# Altium project PCB_XEM-S91.PRJPCB (part 2 of 2)

## Sheet 08_FPGA_D.SchDoc: FPGA Part D: Bank 7-8
size 381 x 266 mm; Organization: Meteroi; Address1: Room 428, 410 Guiping Rd.; Address2: Shanghai 200233, CHINA; SheetNumber: 9; SheetTotal: 11; PageSetup: Record=PageOptions|CenterHorizontal=True|CenterVertical=True|PrintScale=0.75|XCorrection=1.00|YCorrection=1.00|PrintKind=2|BorderSize=5000000|LeftOffset=0|BottomOffset=0|Orientation=2|PaperLength=1000|PaperWidth=1000|Scale=100|PaperSource=276|PrintQuality=-3|MediaType=1|DitherType=10|PaperKind=A4|PrintScaleMode=1
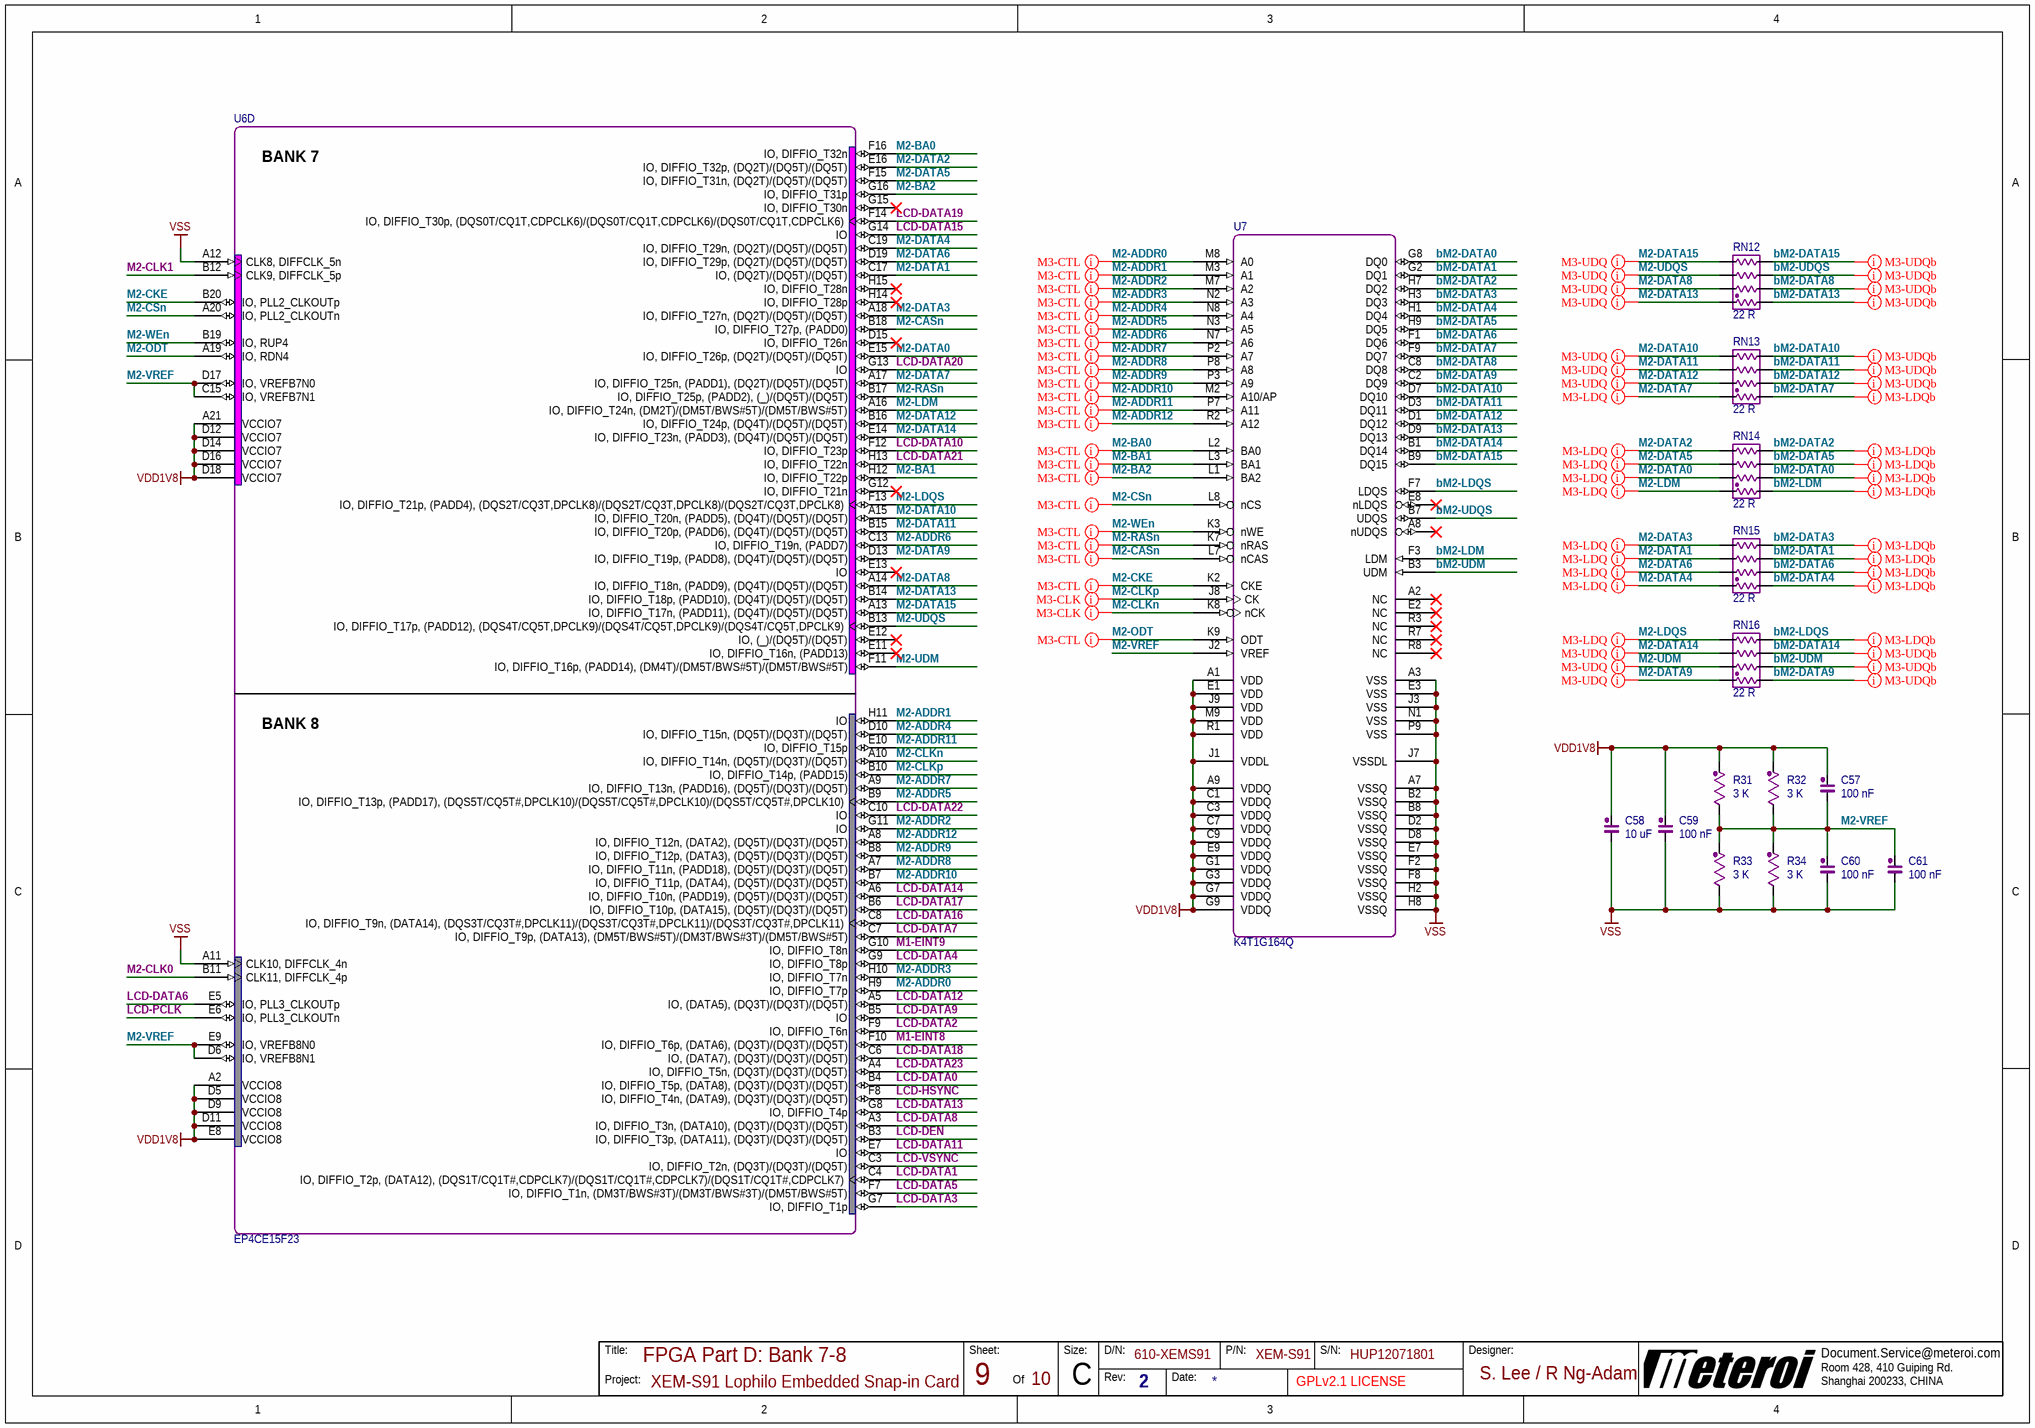
[diagram p7: 08_FPGA_D.SchDoc]

### Parts
C57  100 nF  [0402A1]
C58  10 uF  [0603A1]
C59  100 nF  [0402A1]
C60  100 nF  [0402A1]
C61  100 nF  [0402BG]
R31  3 K  [0402A2]
R32  3 K  [0402A2]
R33  3 K  [0402A2]
R34  3 K  [0402A2]
RN12  22 R  [0402PR4]
RN13  22 R  [0402PR4]
RN14  22 R  [0402PR4]
RN15  22 R  [0402PR4]
RN16  22 R  [0402PR4]
U6  EP4CE15F23  [FBGA-484]  (part D of 5)
U7  K4T1G164Q  [FBGA-DDR-84]

### Nets
VDD1V8: C57.2 C58.2 C59.2 R31.2 R32.2 U6.A2(VCCIO8) U6.A21(VCCIO7) U6.D5(VCCIO8) U6.D9(VCCIO8) U6.D11(VCCIO8) U6.D12(VCCIO7) U6.D14(VCCIO7) U6.D16(VCCIO7) U6.D18(VCCIO7) U6.E8(VCCIO8) U7.A1(VDD) U7.A9(VDDQ) U7.C1(VDDQ) U7.C3(VDDQ) U7.C7(VDDQ) U7.C9(VDDQ) U7.E1(VDD) U7.E9(VDDQ) U7.G1(VDDQ) U7.G3(VDDQ) U7.G7(VDDQ) U7.G9(VDDQ) U7.J1(VDDL) U7.J9(VDD) U7.M9(VDD) U7.R1(VDD)
VSS: C58.1 C59.1 C60.1 C61.1 R33.1 R34.1 U6.A11(CLK10,_DIFFCLK_4n) U6.A12(CLK8,_DIFFCLK_5n) U7.A3(VSS) U7.A7(VSSQ) U7.B2(VSSQ) U7.B8(VSSQ) U7.D2(VSSQ) U7.D8(VSSQ) U7.E3(VSS) U7.E7(VSSQ) U7.F2(VSSQ) U7.F8(VSSQ) U7.H2(VSSQ) U7.H8(VSSQ) U7.J3(VSS) U7.J7(VSSDL) U7.N1(VSS) U7.P9(VSS)
bM2-DATA0: RN14.4 U7.G8(DQ0)
bM2-DATA1: RN15.6 U7.G2(DQ1)
bM2-DATA2: RN14.8 U7.H7(DQ2)
bM2-DATA3: RN15.8 U7.H3(DQ3)
bM2-DATA4: RN15.2 U7.H1(DQ4)
bM2-DATA5: RN14.6 U7.H9(DQ5)
bM2-DATA6: RN15.4 U7.F1(DQ6)
bM2-DATA7: RN13.2 U7.F9(DQ7)
bM2-DATA8: RN12.4 U7.C8(DQ8)
bM2-DATA9: RN16.2 U7.C2(DQ9)
bM2-DATA10: RN13.8 U7.D7(DQ10)
bM2-DATA11: RN13.6 U7.D3(DQ11)
bM2-DATA12: RN13.4 U7.D1(DQ12)
bM2-DATA13: RN12.2 U7.D9(DQ13)
bM2-DATA14: RN16.6 U7.B1(DQ14)
bM2-DATA15: RN12.8 U7.B9(DQ15)
bM2-LDM: RN14.2 U7.F3(LDM)
bM2-LDQS: RN16.8 U7.F7(LDQS)
bM2-UDM: RN16.4 U7.B3(UDM)
bM2-UDQS: RN12.6 U7.B7(UDQS)
LCD-DATA0: U6.B4(IO,_DIFFIO_T5p,_(DATA8),_(DQ3T)/(DQ3T)/(DQ5T))
LCD-DATA1: U6.C4(IO,_DIFFIO_T2p,_(DATA12),_(DQS1T/CQ1T#,CDPCLK7)/(DQS1T/CQ1T#,CDPCLK7)/(DQS1T/CQ1T#,CDPCLK7))
LCD-DATA2: U6.F9(IO,_DIFFIO_T6n)
LCD-DATA3: U6.G7(IO,_DIFFIO_T1p)
LCD-DATA4: U6.G9(IO,_DIFFIO_T8p)
LCD-DATA5: U6.F7(IO,_DIFFIO_T1n,_(DM3T/BWS#3T)/(DM3T/BWS#3T)/(DM5T/BWS#5T))
LCD-DATA6: U6.E5(IO,_PLL3_CLKOUTp)
LCD-DATA7: U6.C7(IO,_DIFFIO_T9p,_(DATA13),_(DM5T/BWS#5T)/(DM3T/BWS#3T)/(DM5T/BWS#5T))
LCD-DATA8: U6.A3(IO,_DIFFIO_T3n,_(DATA10),_(DQ3T)/(DQ3T)/(DQ5T))
LCD-DATA9: U6.B5(IO)
LCD-DATA10: U6.F12(IO,_DIFFIO_T23p)
LCD-DATA11: U6.E7(IO)
LCD-DATA12: U6.A5(IO,_(DATA5),_(DQ3T)/(DQ3T)/(DQ5T))
LCD-DATA13: U6.G8(IO,_DIFFIO_T4p)
LCD-DATA14: U6.A6(IO,_DIFFIO_T10n,_(PADD19),_(DQ5T)/(DQ3T)/(DQ5T))
LCD-DATA15: U6.G14(IO)
LCD-DATA16: U6.C8(IO,_DIFFIO_T9n,_(DATA14),_(DQS3T/CQ3T#,DPCLK11)/(DQS3T/CQ3T#,DPCLK11)/(DQS3T/CQ3T#,DPCLK11))
LCD-DATA17: U6.B6(IO,_DIFFIO_T10p,_(DATA15),_(DQ5T)/(DQ3T)/(DQ5T))
LCD-DATA18: U6.C6(IO,_(DATA7),_(DQ3T)/(DQ3T)/(DQ5T))
LCD-DATA19: U6.F14(IO,_DIFFIO_T30p,_(DQS0T/CQ1T,CDPCLK6)/(DQS0T/CQ1T,CDPCLK6)/(DQS0T/CQ1T,CDPCLK6))
LCD-DATA20: U6.G13(IO)
LCD-DATA21: U6.H13(IO,_DIFFIO_T22n)
LCD-DATA22: U6.C10(IO)
LCD-DATA23: U6.A4(IO,_DIFFIO_T5n,_(DQ3T)/(DQ3T)/(DQ5T))
LCD-DEN: U6.B3(IO,_DIFFIO_T3p,_(DATA11),_(DQ3T)/(DQ3T)/(DQ5T))
LCD-HSYNC: U6.F8(IO,_DIFFIO_T4n,_(DATA9),_(DQ3T)/(DQ3T)/(DQ5T))
LCD-PCLK: U6.E6(IO,_PLL3_CLKOUTn)
LCD-VSYNC: U6.C3(IO,_DIFFIO_T2n,_(DQ3T)/(DQ3T)/(DQ5T))
M1-EINT8: U6.F10(IO,_DIFFIO_T6p,_(DATA6),_(DQ3T)/(DQ3T)/(DQ5T))
M1-EINT9: U6.G10(IO,_DIFFIO_T8n)
M2-ADDR0: U6.H9(IO,_DIFFIO_T7p) U7.M8(A0)
M2-ADDR1: U6.H11(IO) U7.M3(A1)
M2-ADDR2: U6.G11(IO) U7.M7(A2)
M2-ADDR3: U6.H10(IO,_DIFFIO_T7n) U7.N2(A3)
M2-ADDR4: U6.D10(IO,_DIFFIO_T15n,_(DQ5T)/(DQ3T)/(DQ5T)) U7.N8(A4)
M2-ADDR5: U6.B9(IO,_DIFFIO_T13p,_(PADD17),_(DQS5T/CQ5T#,DPCLK10)/(DQS5T/CQ5T#,DPCLK10)/(DQS5T/CQ5T#,DPCLK10)) U7.N3(A5)
M2-ADDR6: U6.C13(IO,_DIFFIO_T19n,_(PADD7)) U7.N7(A6)
M2-ADDR7: U6.A9(IO,_DIFFIO_T13n,_(PADD16),_(DQ5T)/(DQ3T)/(DQ5T)) U7.P2(A7)
M2-ADDR8: U6.A7(IO,_DIFFIO_T11n,_(PADD18),_(DQ5T)/(DQ3T)/(DQ5T)) U7.P8(A8)
M2-ADDR9: U6.B8(IO,_DIFFIO_T12p,_(DATA3),_(DQ5T)/(DQ3T)/(DQ5T)) U7.P3(A9)
M2-ADDR10: U6.B7(IO,_DIFFIO_T11p,_(DATA4),_(DQ5T)/(DQ3T)/(DQ5T)) U7.M2(A10/AP)
M2-ADDR11: U6.E10(IO,_DIFFIO_T15p) U7.P7(A11)
M2-ADDR12: U6.A8(IO,_DIFFIO_T12n,_(DATA2),_(DQ5T)/(DQ3T)/(DQ5T)) U7.R2(A12)
M2-BA0: U6.F16(IO,_DIFFIO_T32n) U7.L2(BA0)
M2-BA1: U6.H12(IO,_DIFFIO_T22p) U7.L3(BA1)
M2-BA2: U6.G16(IO,_DIFFIO_T31p) U7.L1(BA2)
M2-CASn: U6.B18(IO,_DIFFIO_T27p,_(PADD0)) U7.L7(nCAS)
M2-CKE: U6.B20(IO,_PLL2_CLKOUTp) U7.K2(CKE)
M2-CLK0: U6.B11(CLK11,_DIFFCLK_4p)
M2-CLK1: U6.B12(CLK9,_DIFFCLK_5p)
M2-CLKn: U6.A10(IO,_DIFFIO_T14n,_(DQ5T)/(DQ3T)/(DQ5T)) U7.K8(nCK)
M2-CLKp: U6.B10(IO,_DIFFIO_T14p,_(PADD15)) U7.J8(CK)
M2-CSn: U6.A20(IO,_PLL2_CLKOUTn) U7.L8(nCS)
M2-DATA0: RN14.3 U6.E15(IO,_DIFFIO_T26p,_(DQ2T)/(DQ5T)/(DQ5T))
M2-DATA1: RN15.5 U6.C17(IO,_(DQ2T)/(DQ5T)/(DQ5T))
M2-DATA2: RN14.7 U6.E16(IO,_DIFFIO_T32p,_(DQ2T)/(DQ5T)/(DQ5T))
M2-DATA3: RN15.7 U6.A18(IO,_DIFFIO_T27n,_(DQ2T)/(DQ5T)/(DQ5T))
M2-DATA4: RN15.1 U6.C19(IO,_DIFFIO_T29n,_(DQ2T)/(DQ5T)/(DQ5T))
M2-DATA5: RN14.5 U6.F15(IO,_DIFFIO_T31n,_(DQ2T)/(DQ5T)/(DQ5T))
M2-DATA6: RN15.3 U6.D19(IO,_DIFFIO_T29p,_(DQ2T)/(DQ5T)/(DQ5T))
M2-DATA7: RN13.1 U6.A17(IO,_DIFFIO_T25n,_(PADD1),_(DQ2T)/(DQ5T)/(DQ5T))
M2-DATA8: RN12.3 U6.A14(IO,_DIFFIO_T18n,_(PADD9),_(DQ4T)/(DQ5T)/(DQ5T))
M2-DATA9: RN16.1 U6.D13(IO,_DIFFIO_T19p,_(PADD8),_(DQ4T)/(DQ5T)/(DQ5T))
M2-DATA10: RN13.7 U6.A15(IO,_DIFFIO_T20n,_(PADD5),_(DQ4T)/(DQ5T)/(DQ5T))
M2-DATA11: RN13.5 U6.B15(IO,_DIFFIO_T20p,_(PADD6),_(DQ4T)/(DQ5T)/(DQ5T))
M2-DATA12: RN13.3 U6.B16(IO,_DIFFIO_T24p,_(DQ4T)/(DQ5T)/(DQ5T))
M2-DATA13: RN12.1 U6.B14(IO,_DIFFIO_T18p,_(PADD10),_(DQ4T)/(DQ5T)/(DQ5T))
M2-DATA14: RN16.5 U6.E14(IO,_DIFFIO_T23n,_(PADD3),_(DQ4T)/(DQ5T)/(DQ5T))
M2-DATA15: RN12.7 U6.A13(IO,_DIFFIO_T17n,_(PADD11),_(DQ4T)/(DQ5T)/(DQ5T))
M2-LDM: RN14.1 U6.A16(IO,_DIFFIO_T24n,_(DM2T)/(DM5T/BWS#5T)/(DM5T/BWS#5T))
M2-LDQS: RN16.7 U6.F13(IO,_DIFFIO_T21p,_(PADD4),_(DQS2T/CQ3T,DPCLK8)/(DQS2T/CQ3T,DPCLK8)/(DQS2T/CQ3T,DPCLK8))
M2-ODT: U6.A19(IO,_RDN4) U7.K9(ODT)
M2-RASn: U6.B17(IO,_DIFFIO_T25p,_(PADD2),_(_)/(DQ5T)/(DQ5T)) U7.K7(nRAS)
M2-UDM: RN16.3 U6.F11(IO,_DIFFIO_T16p,_(PADD14),_(DM4T)/(DM5T/BWS#5T)/(DM5T/BWS#5T))
M2-UDQS: RN12.5 U6.B13(IO,_DIFFIO_T17p,_(PADD12),_(DQS4T/CQ5T,DPCLK9)/(DQS4T/CQ5T,DPCLK9)/(DQS4T/CQ5T,DPCLK9))
M2-VREF: C57.1 C60.2 C61.2 R31.1 R32.1 R33.2 R34.2 U6.C15(IO,_VREFB7N1) U6.D6(IO,_VREFB8N1) U6.D17(IO,_VREFB7N0) U6.E9(IO,_VREFB8N0) U7.J2(VREF)
M2-WEn: U6.B19(IO,_RUP4) U7.K3(nWE)

Not connected (* = marked no-connect by the designer): U6 D15(IO,_DIFFIO_T26n)* E11(IO,_DIFFIO_T16n,_(PADD13))* E12(IO,_(_)/(DQ5T)/(DQ5T))* E13(IO)* G12(IO,_DIFFIO_T21n)* G15(IO,_DIFFIO_T30n)* H14(IO,_DIFFIO_T28p)* H15(IO,_DIFFIO_T28n)*; U7 A2(NC)* A8(nUDQS)* E2(NC)* E8(nLDQS)* R3(NC)* R7(NC)* R8(NC)*

### Layout directives
net class M3_CTL: M2-ADDR0, M2-ADDR1, M2-ADDR2, M2-ADDR3, M2-ADDR4, M2-ADDR5, M2-ADDR6, M2-ADDR7, M2-ADDR8, M2-ADDR9, M2-ADDR10, M2-ADDR11, M2-ADDR12, M2-BA0, M2-BA1, M2-BA2, M2-CASn, M2-CKE, M2-CSn, M2-ODT, M2-RASn, M2-WEn
net class M3-CLK: M2-CLKn, M2-CLKp
net class M3-UDQ: M2-DATA8, M2-DATA9, M2-DATA10, M2-DATA11, M2-DATA12, M2-DATA13, M2-DATA14, M2-DATA15, M2-UDM, M2-UDQS
net class M3-LDQ: M2-DATA0, M2-DATA1, M2-DATA2, M2-DATA3, M2-DATA4, M2-DATA5, M2-DATA6, M2-DATA7, M2-LDM, M2-LDQS
net class M3-LDQb: bM2-DATA0, bM2-DATA1, bM2-DATA2, bM2-DATA3, bM2-DATA4, bM2-DATA5, bM2-DATA6, bM2-DATA7, bM2-LDM, bM2-LDQS
net class M3-UDQb: bM2-DATA8, bM2-DATA9, bM2-DATA10, bM2-DATA11, bM2-DATA12, bM2-DATA13, bM2-DATA14, bM2-DATA15, bM2-UDM, bM2-UDQS

### Notes on the sheet
- Title:
- Project:
- Sheet:
- Of
- Size:
- D/N:
- Rev:
- Date:
- P/N:
- S/N:
- Designer:
- C
- (in symbol EP4CE15F23, part D) BANK 7; BANK 8

### Library data of the parts
C57 C59-C61 = CAP: Normal Capacitor; PartNumber: 0; Vendor: muRata; Designer: shyul; PinCountSMD: 2; Value: 100 nF; SerialNumber: 0; Publisher: Cowin; PCBMarker: Capacitor; Version: 1.0; VersionDate: 04-27-2011; PinCountHole: 0
C58 = CAP: Normal Capacitor; PartNumber: 0; Value: 100 nF; Vendor: muRata; Designer: shyul; PinCountSMD: 2; SerialNumber: 0; Publisher: Cowin; PCBMarker: Capacitor; Version: 1.0; VersionDate: 04-27-2011; PinCountHole: 0
R31-R34 = RES: Normal Resistor; PartNumber: 0; Vendor: KOA; Designer: shyul; PinCountSMD: 2; SerialNumber: 0; Value: 3 K; Version: 1.0; VersionDate: 04-27-2011; PCBMarker: Resistor; Publisher: Cowin; PinCountHole: 0
RN12-RN16 = RES_N4: Resistor Array x4; PartNumber: YC124-JR-0722RL; SerialNumber: 0; Vendor: YAGEO; Designer: shyul; PinCountSMD: 8; Value: 22 R; Version: 1.0; VersionDate: 04-27-2011; Publisher: Cowin; PCBMarker: Resistor Array; PinCountHole: 0
U6 = EP4CE15F23: Cyclone IV EP4CE15F23 FPGA; PartNumber: EP4CE15F23C8N; SerialNumber: 0; Vendor: Altera; Designer: shyul; PCBMarker: FPGA; Version: 1.0; VersionDate: 2-17-2012; Value: EP4CE15F23; Publisher: Cowin
U7 = K4T1G164Q: K4T1G164Q 64M x16 DDR2 SDRAM; PartNumber: K4T1G164QF-BCE7; SerialNumber: 0; Vendor: SUMSUNG; Designer: shyul; PCBMarker: DDR2; Version: 1.0; VersionDate: 2-16-2012; Value: K4T1G164Q; Publisher: Cowin

## Sheet 09_FPGA_E.SchDoc: FPGA Part E: System / Power
size 381 x 266 mm; Organization: Meteroi; Address1: Room 428, 410 Guiping Rd.; Address2: Shanghai 200233, CHINA; SheetNumber: 10; SheetTotal: 11; PageSetup: Record=PageOptions|CenterHorizontal=True|CenterVertical=True|PrintScale=0.75|XCorrection=1.00|YCorrection=1.00|PrintKind=2|BorderSize=5000000|LeftOffset=0|BottomOffset=0|Orientation=2|PaperLength=1000|PaperWidth=1000|Scale=100|PaperSource=276|PrintQuality=-3|MediaType=1|DitherType=10|PaperKind=A4|PrintScaleMode=1
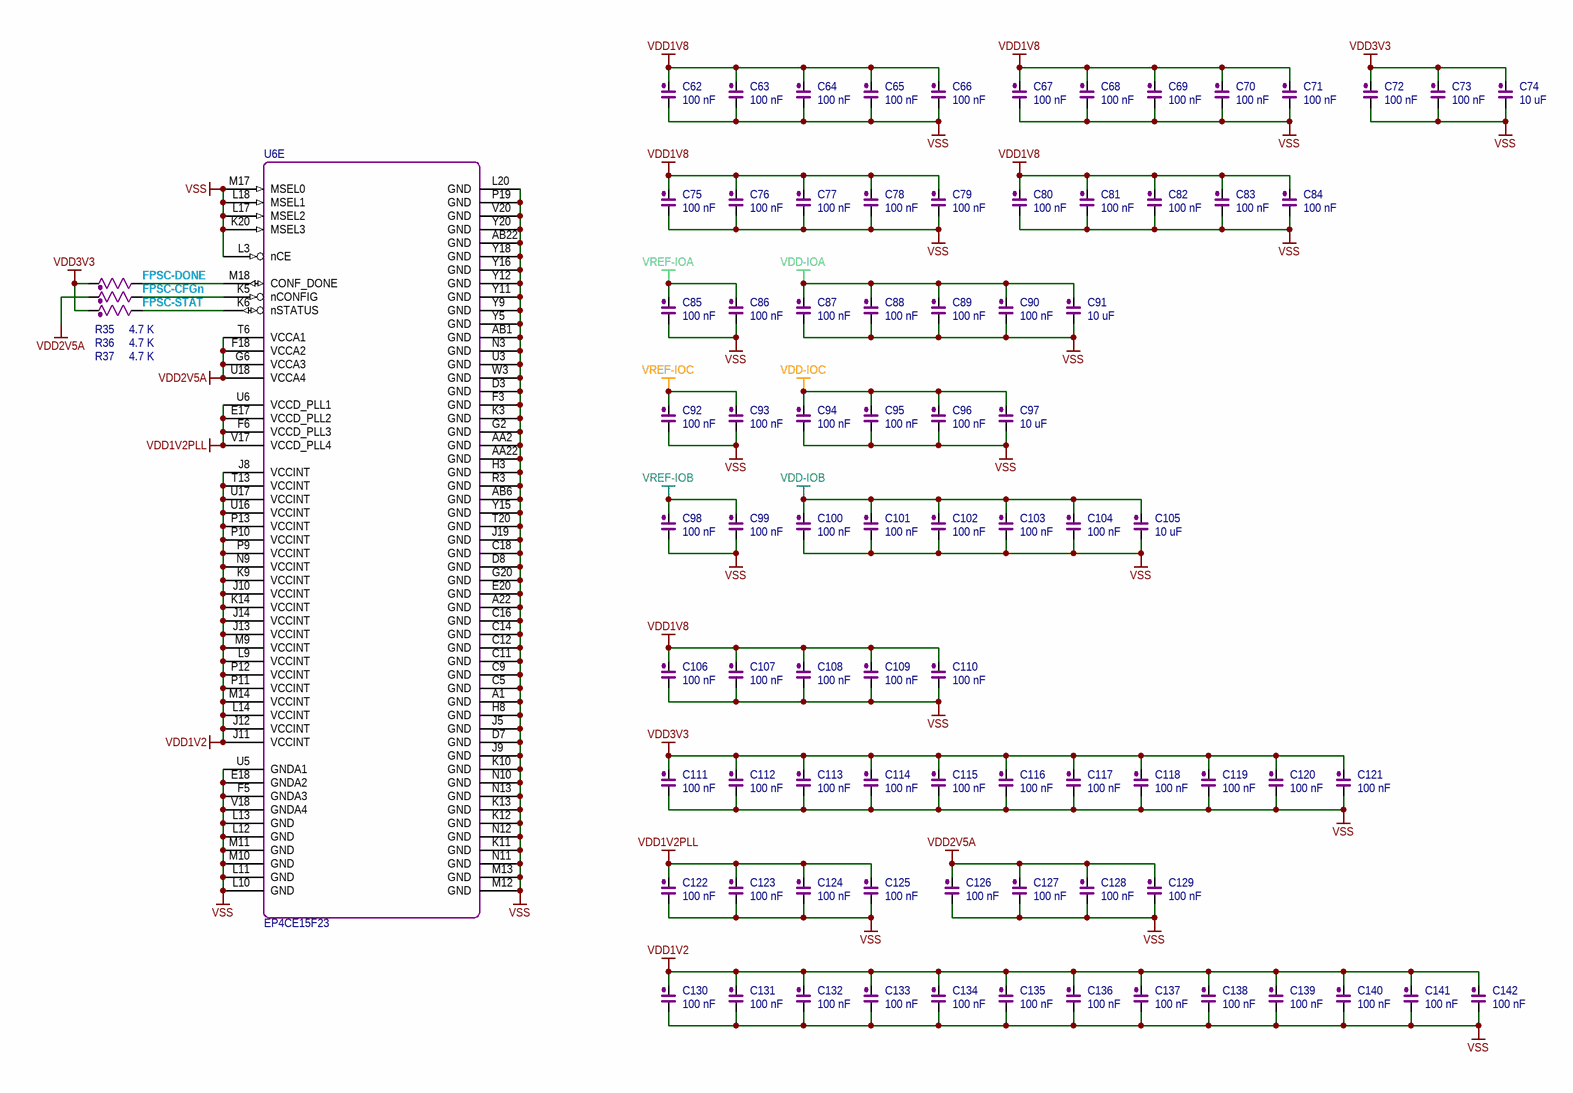
[diagram p8: 09_FPGA_E.SchDoc]

### Parts
C62  100 nF  [0402A1]
C63  100 nF  [0402A1]
C64  100 nF  [0402A1]
C65  100 nF  [0402A1]
C66  100 nF  [0402A1]
C67  100 nF  [0402A1]
C68  100 nF  [0402A1]
C69  100 nF  [0402A1]
C70  100 nF  [0402A1]
C71  100 nF  [0402A1]
C72  100 nF  [0402A1]
C73  100 nF  [0402A1]
C74  10 uF  [0603A1]
C75  100 nF  [0402A1]
C76  100 nF  [0402A1]
C77  100 nF  [0402A1]
C78  100 nF  [0402A1]
C79  100 nF  [0402A1]
C80  100 nF  [0402A1]
C81  100 nF  [0402A1]
C82  100 nF  [0402A1]
C83  100 nF  [0402A1]
C84  100 nF  [0402A1]
C85  100 nF  [0402A1]
C86  100 nF  [0402A1]
C87  100 nF  [0402A1]
C88  100 nF  [0402A1]
C89  100 nF  [0402A1]
C90  100 nF  [0402A1]
C91  10 uF  [0603A1]
C92  100 nF  [0402A1]
C93  100 nF  [0402A1]
C94  100 nF  [0402A1]
C95  100 nF  [0402A1]
C96  100 nF  [0402A1]
C97  10 uF  [0603A1]
C98  100 nF  [0402A1]
C99  100 nF  [0402A1]
C100  100 nF  [0402A1]
C101  100 nF  [0402A1]
C102  100 nF  [0402A1]
C103  100 nF  [0402BG]
C104  100 nF  [0402BG]
C105  10 uF  [0603A1]
C106  100 nF  [0402BG]
C107  100 nF  [0402BG]
C108  100 nF  [0402BG]
C109  100 nF  [0402BG]
C110  100 nF  [0402BG]
C111  100 nF  [0402BG]
C112  100 nF  [0402BG]
C113  100 nF  [0402BG]
C114  100 nF  [0402BG]
C115  100 nF  [0402BG]
C116  100 nF  [0402BG]
C117  100 nF  [0402BG]
C118  100 nF  [0402BG]
C119  100 nF  [0402BG]
C120  100 nF  [0402BG]
C121  100 nF  [0402BG]
C122  100 nF  [0402BG]
C123  100 nF  [0402BG]
C124  100 nF  [0402BG]
C125  100 nF  [0402BG]
C126  100 nF  [0402BG]
C127  100 nF  [0402BG]
C128  100 nF  [0402BG]
C129  100 nF  [0402BG]
C130  100 nF  [0402BG]
C131  100 nF  [0402BG]
C132  100 nF  [0402BG]
C133  100 nF  [0402BG]
C134  100 nF  [0402BG]
C135  100 nF  [0402BG]
C136  100 nF  [0402BG]
C137  100 nF  [0402BG]
C138  100 nF  [0402BG]
C139  100 nF  [0402BG]
C140  100 nF  [0402BG]
C141  100 nF  [0402BG]
C142  100 nF  [0402BG]
R35  4.7 K  [0402A2]
R36  4.7 K  [0402A2]
R37  4.7 K  [0402A2]
U6  EP4CE15F23  [FBGA-484]  (part E of 5)

### Nets
VDD1V2: C130.2 C131.2 C132.2 C133.2 C134.2 C135.2 C136.2 C137.2 C138.2 C139.2 C140.2 C141.2 C142.2 U6.J8(VCCINT) U6.J10(VCCINT) U6.J11(VCCINT) U6.J12(VCCINT) U6.J13(VCCINT) U6.J14(VCCINT) U6.K9(VCCINT) U6.K14(VCCINT) U6.L9(VCCINT) U6.L14(VCCINT) U6.M9(VCCINT) U6.M14(VCCINT) U6.N9(VCCINT) U6.P9(VCCINT) U6.P10(VCCINT) U6.P11(VCCINT) U6.P12(VCCINT) U6.P13(VCCINT) U6.T13(VCCINT) U6.U16(VCCINT) U6.U17(VCCINT)
VDD1V2PLL: C122.2 C123.2 C124.2 C125.2 U6.E17(VCCD_PLL2) U6.F6(VCCD_PLL3) U6.U6(VCCD_PLL1) U6.V17(VCCD_PLL4)
VDD1V8: C62.2 C63.2 C64.2 C65.2 C66.2 C67.2 C68.2 C69.2 C70.2 C71.2 C75.2 C76.2 C77.2 C78.2 C79.2 C80.2 C81.2 C82.2 C83.2 C84.2 C106.2 C107.2 C108.2 C109.2 C110.2
VDD2V5A: C126.2 C127.2 C128.2 C129.2 R36.2 U6.F18(VCCA2) U6.G6(VCCA3) U6.T6(VCCA1) U6.U18(VCCA4)
VDD3V3: C72.2 C73.2 C74.2 C111.2 C112.2 C113.2 C114.2 C115.2 C116.2 C117.2 C118.2 C119.2 C120.2 C121.2 R35.2 R37.2
VDD-IOA: C87.2 C88.2 C89.2 C90.2 C91.2
VDD-IOB: C100.2 C101.2 C102.2 C103.2 C104.2 C105.2
VDD-IOC: C94.2 C95.2 C96.2 C97.2
VREF-IOA: C85.2 C86.2
VREF-IOB: C98.2 C99.2
VREF-IOC: C92.2 C93.2
VSS: C62.1 C63.1 C64.1 C65.1 C66.1 C67.1 C68.1 C69.1 C70.1 C71.1 C72.1 C73.1 C74.1 C75.1 C76.1 C77.1 C78.1 C79.1 C80.1 C81.1 C82.1 C83.1 C84.1 C85.1 C86.1 C87.1 C88.1 C89.1 C90.1 C91.1 C92.1 C93.1 C94.1 C95.1 C96.1 C97.1 C98.1 C99.1 C100.1 C101.1 C102.1 C103.1 C104.1 C105.1 C106.1 C107.1 C108.1 C109.1 C110.1 C111.1 C112.1 C113.1 C114.1 C115.1 C116.1 C117.1 C118.1 C119.1 C120.1 C121.1 C122.1 C123.1 C124.1 C125.1 C126.1 C127.1 C128.1 C129.1 C130.1 C131.1 C132.1 C133.1 C134.1 C135.1 C136.1 C137.1 C138.1 C139.1 C140.1 C141.1 C142.1 U6.A1(GND) U6.A22(GND) U6.AA2(GND) U6.AA22(GND) U6.AB1(GND) U6.AB6(GND) U6.AB22(GND) U6.C5(GND) U6.C9(GND) U6.C11(GND) U6.C12(GND) U6.C14(GND) U6.C16(GND) U6.C18(GND) U6.D3(GND) U6.D7(GND) U6.D8(GND) U6.E18(GNDA2) U6.E20(GND) U6.F3(GND) U6.F5(GNDA3) U6.G2(GND) U6.G20(GND) U6.H3(GND) U6.H8(GND) U6.J5(GND) U6.J9(GND) U6.J19(GND) U6.K3(GND) U6.K10(GND) U6.K11(GND) U6.K12(GND) U6.K13(GND) U6.K20(MSEL3) U6.L3(nCE) U6.L10(GND) U6.L11(GND) U6.L12(GND) U6.L13(GND) U6.L17(MSEL2) U6.L18(MSEL1) U6.L20(GND) U6.M10(GND) U6.M11(GND) U6.M12(GND) U6.M13(GND) U6.M17(MSEL0) U6.N3(GND) U6.N10(GND) U6.N11(GND) U6.N12(GND) U6.N13(GND) U6.P19(GND) U6.R3(GND) U6.T20(GND) U6.U3(GND) U6.U5(GNDA1) U6.V18(GNDA4) U6.V20(GND) U6.W3(GND) U6.Y5(GND) U6.Y9(GND) U6.Y11(GND) U6.Y12(GND) U6.Y15(GND) U6.Y16(GND) U6.Y18(GND) U6.Y20(GND)
FPSC-CFGn: R36.1 U6.K5(nCONFIG)
FPSC-DONE: R35.1 U6.M18(CONF_DONE)
FPSC-STAT: R37.1 U6.K6(nSTATUS)

### Notes on the sheet
- Title:
- Project:
- Sheet:
- Of
- Size:
- D/N:
- Rev:
- Date:
- P/N:
- S/N:
- Designer:
- C

### Library data of the parts
C62-C142 = CAP: as C57 on sheet 08_FPGA_D; SerialNumber: 0; Publisher: Cowin; PCBMarker: Capacitor; Version: 1.0; VersionDate: 04-27-2011; PinCountHole: 0
  C62-C73 C75-C90 C92-C96 C98-C104 C106-C142: Value: 100 nF
  C74 C91 C97 C105: Value: 10 uF
R35-R37 = RES: as R31-R34 on sheet 08_FPGA_D; SerialNumber: 0; Value: 4.7 K; Version: 1.0; VersionDate: 04-27-2011; PCBMarker: Resistor; Publisher: Cowin; PinCountHole: 0
U6 = EP4CE15F23: as U6 on sheet 08_FPGA_D; PCBMarker: FPGA; Version: 1.0; VersionDate: 2-17-2012; Value: EP4CE15F23; Publisher: Cowin

## Sheet 10_POWER.SchDoc: DCDC Power Supply / Misc.
size 381 x 266 mm; Organization: Meteroi; Address1: Room 428, 410 Guiping Rd.; Address2: Shanghai 200233, CHINA; SheetNumber: 11; SheetTotal: 11; PageSetup: Record=PageOptions|CenterHorizontal=True|CenterVertical=True|PrintScale=0.75|XCorrection=1.00|YCorrection=1.00|PrintKind=2|BorderSize=5000000|LeftOffset=0|BottomOffset=0|Orientation=2|PaperLength=1000|PaperWidth=1000|Scale=100|PaperSource=276|PrintQuality=-3|MediaType=1|DitherType=10|PaperKind=A4|PrintScaleMode=1
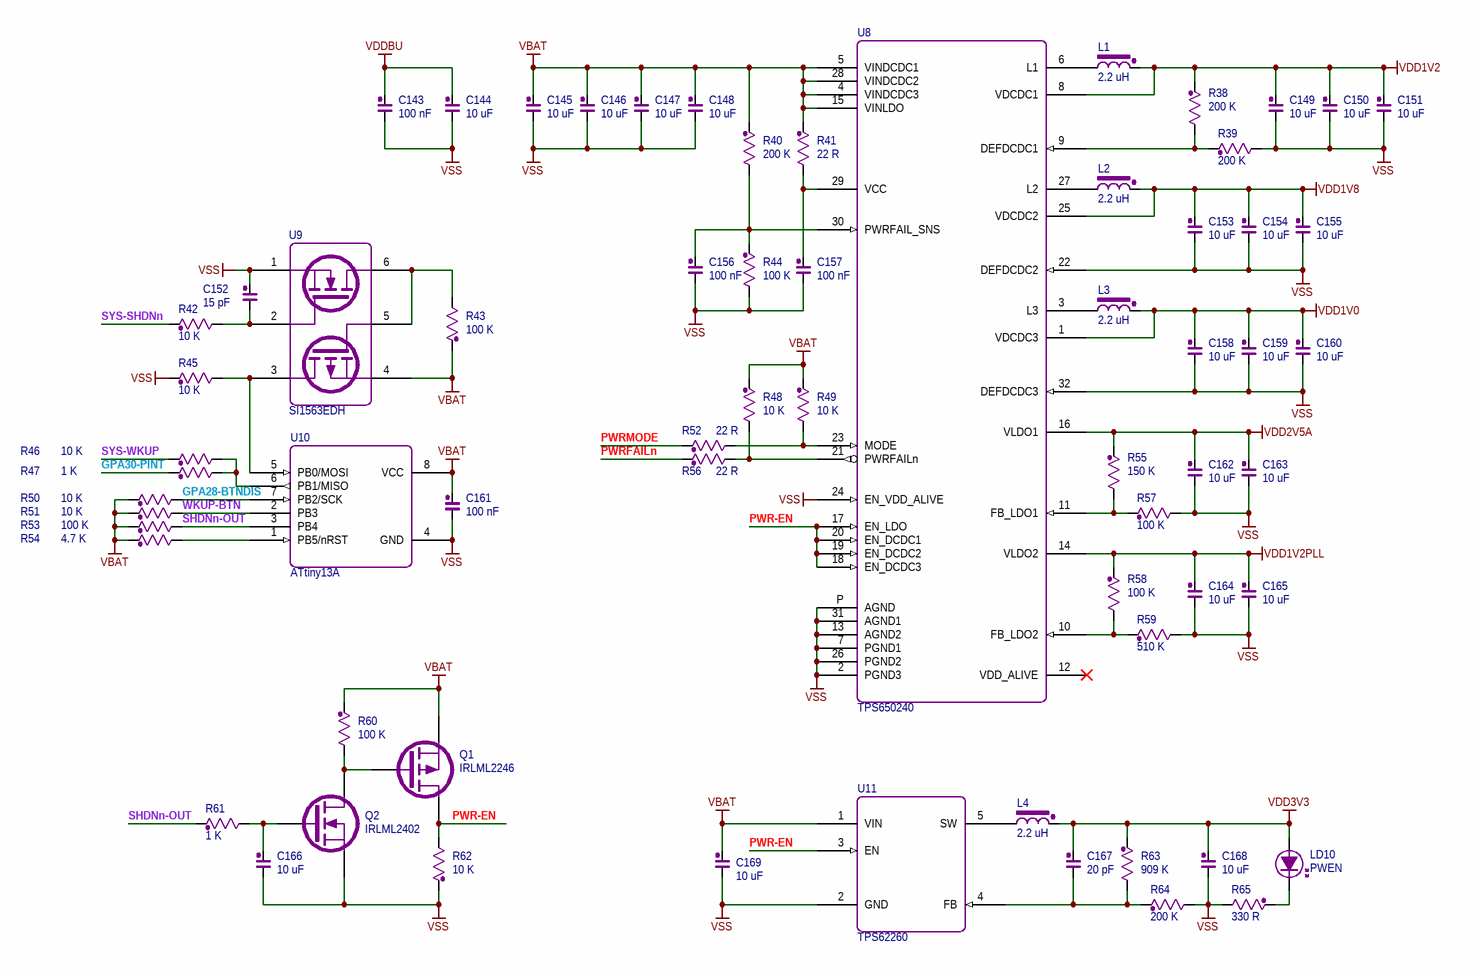
[diagram p9: 10_POWER.SchDoc]

### Parts
C143  100 nF  [0402A1]
C144  10 uF  [0603A1]
C145  10 uF  [0603A1]
C146  10 uF  [0603A1]
C147  10 uF  [0603A1]
C148  10 uF  [0603A1]
C149  10 uF  [0603A1]
C150  10 uF  [0603A1]
C151  10 uF  [0603A1]
C152  15 pF  [0402A1]
C153  10 uF  [0603A1]
C154  10 uF  [0603A1]
C155  10 uF  [0603A1]
C156  100 nF  [0402A1]
C157  100 nF  [0402A1]
C158  10 uF  [0603A1]
C159  10 uF  [0603A1]
C160  10 uF  [0603A1]
C161  100 nF  [0402A1]
C162  10 uF  [0603A1]
C163  10 uF  [0603A1]
C164  10 uF  [0603A1]
C165  10 uF  [0603A1]
C166  10 uF  [0603A1]
C167  20 pF  [0402A1]
C168  10 uF  [0603A1]
C169  10 uF  [0603A1]
L1  2.2 uH  [COIL_S_3X3]
L2  2.2 uH  [COIL_S_3X3]
L3  2.2 uH  [COIL_S_3X3]
L4  2.2 uH  [COIL_S_3X3]
LD10  PWEN  [0603LD]
Q1  IRLML2246  [SOT-23-3]
Q2  IRLML2402  [SOT-23-3]
R38  200 K  [0402A2]
R39  200 K  [0402A2]
R40  200 K  [0402A2]
R41  22 R  [0402A2]
R42  10 K  [0402A2]
R43  100 K  [0402A2]
R44  100 K  [0402A2]
R45  10 K  [0402A2]
R46  10 K  [0402A2]
R47  1 K  [0402A2]
R48  10 K  [0402A2]
R49  10 K  [0402A2]
R50  10 K  [0402A2]
R51  10 K  [0402A2]
R52  22 R  [0402A2]
R53  100 K  [0402A2]
R54  4.7 K  [0402A2]
R55  150 K  [0402A2]
R56  22 R  [0402A2]
R57  100 K  [0402A2]
R58  100 K  [0402A2]
R59  510 K  [0402A2]
R60  100 K  [0402A2]
R61  1 K  [0402A2]
R62  10 K  [0402A2]
R63  909 K  [0402A2]
R64  200 K  [0402A2]
R65  330 R  [0402A2]
U8  TPS650240  [QFN-5-32]
U9  SI1563EDH  [SOT-363]
U10  ATtiny13A  [SOIC-8W]
U11  TPS62260  [SOT-23-5]

### Nets
VBAT: C145.2 C146.2 C147.2 C148.2 C161.2 C169.2 Q1.3(S) R40.2 R41.2 R43.2 R48.2 R49.2 R50.2 R51.2 R53.2 R54.2 R60.2 U8.4(VINDCDC3) U8.5(VINDCDC1) U8.15(VINLDO) U8.28(VINDCDC2) U9.4 U10.8(VCC) U11.1(VIN)
VDD1V0: C158.2 C159.2 C160.2 L3.2 U8.1(VDCDC3)
VDD1V2: C149.2 C150.2 C151.2 L1.2 R38.2 U8.8(VDCDC1)
VDD1V2PLL: C164.2 C165.2 R58.2 U8.14(VLDO2)
VDD1V8: C153.2 C154.2 C155.2 L2.2 U8.25(VDCDC2)
VDD2V5A: C162.2 C163.2 R55.2 U8.16(VLDO1)
VDD3V3: C167.2 C168.2 L4.2 LD10.2 R63.2
VDDBU: C143.2 C144.2
VSS: C143.1 C144.1 C145.1 C146.1 C147.1 C148.1 C149.1 C150.1 C151.1 C152.2 C153.1 C154.1 C155.1 C156.1 C157.1 C158.1 C159.1 C160.1 C161.1 C162.1 C163.1 C164.1 C165.1 C166.1 C168.1 C169.1 Q2.3(S) R39.1 R44.1 R45.2 R57.1 R59.1 R62.2 R64.1 R65.1 U8.2(PGND3) U8.7(PGND1) U8.13(AGND2) U8.22(DEFDCDC2) U8.24(EN_VDD_ALIVE) U8.26(PGND2) U8.31(AGND1) U8.32(DEFDCDC3) U8.P(AGND) U9.1 U10.4(GND) U11.2(GND)
GPA28-BTNDIS: R50.1 U10.7(PB2/SCK)
GPA30-PINT: R47.2
PWR-EN: Q1.2(D) R62.1 U8.17(EN_LDO) U8.18(EN_DCDC3) U8.19(EN_DCDC2) U8.20(EN_DCDC1) U11.3(EN)
PWRFAILn: R56.2
PWRMODE: R52.2
SHDNn-OUT: R53.1 R61.2 U10.3(PB4)
SYS-SHDNn: R42.2
SYS-WKUP: R46.2
WKUP-BTN: R51.1 U10.2(PB3)
NetC152_1: C152.1 R42.1 U9.2
NetC156_2: C156.2 R40.1 R44.2 U8.30(PWRFAIL_SNS)
NetC157_2: C157.2 R41.1 U8.29(VCC)
NetC166_2: C166.2 Q2.1(G) R61.1
NetC167_1: C167.1 R63.1 R64.2 U11.4(FB)
NetL1_1: L1.1 U8.6(L1)
NetL2_1: L2.1 U8.27(L2)
NetL3_1: L3.1 U8.3(L3)
NetL4_1: L4.1 U11.5(SW)
NetLD10_1: LD10.1 R65.2
NetQ1_1: Q1.1(G) Q2.2(D) R60.1
NetR38_1: R38.1 R39.2 U8.9(DEFDCDC1)
NetR43_1: R43.1 U9.5 U9.6
NetR45_1: R45.1 U9.3 U10.5(PB0/MOSI)
NetR46_1: R46.1 R47.1 U10.6(PB1/MISO)
NetR48_1: R48.1 R56.1 U8.21(PWRFAILn)
NetR49_1: R49.1 R52.1 U8.23(MODE)
NetR54_1: R54.1 U10.1(PB5/nRST)
NetR55_1: R55.1 R57.2 U8.11(FB_LDO1)
NetR58_1: R58.1 R59.2 U8.10(FB_LDO2)

Not connected (* = marked no-connect by the designer): U8 12(VDD_ALIVE)*

### Notes on the sheet
- Title:
- Project:
- Sheet:
- Of
- Size:
- D/N:
- Rev:
- Date:
- P/N:
- S/N:
- Designer:
- C

### Library data of the parts
C143-C169 = CAP: as C57 on sheet 08_FPGA_D; SerialNumber: 0; Publisher: Cowin; PCBMarker: Capacitor; Version: 1.0; VersionDate: 04-27-2011; PinCountHole: 0
  C143 C156 C157 C161: Value: 100 nF
  C144-C151 C153-C155 C158-C160 C162-C166 C168 C169: Value: 10 uF
  C152: Value: 15 pF
  C167: Value: 20 pF
L1-L4 = COIL: Power Coil Inductor; PartNumber: LPD3015-222ML; Vendor: Coilcraft; Designer: shyul; PCBMarker: Power Inductor; SerialNumber: 0; PinCountSMD: 2; Value: 2.2 uH; Version: 1.0; VersionDate: 04-27-2011; Publisher: Cowin; PinCountHole: 0
LD10 = LED: LED Single; PartNumber: 0; Value: Red; Designer: shyul; Vendor: Luckylight; PinCountSMD: 2; Status: PWEN; Version: 1.0; Publisher: Cowin; SerialNumber: 0; VersionDate: 04-27-2011; PCBMarker: LED; PinCountHole: 0
Q1 = MOSFET_EP: P Channel Enhancement MOSFET; PartNumber: IRLML2246TRPbF; Vendor: ONSemi; Designer: shyul; SerialNumber: 0; PinCountSMD: 3; Value: IRLML2246; Version: 0.1; VersionDate: 04-28-2011; Publisher: Cowin; PCBMarker: MOSFET; PinCountHole: 0
Q2 = MOSFET_EN: N Channel Enhancement MOSFET; PartNumber: IRLML2402GPbF; SerialNumber: 0; Designer: shyul; Vendor: ONSemi; PinCountSMD: 3; Publisher: Cowin; Value: IRLML2402; PCBMarker: MOSFET; Version: 0.1; VersionDate: 04-28-2011; PinCountHole: 0
R38-R65 = RES: as R31-R34 on sheet 08_FPGA_D; SerialNumber: 0; Version: 1.0; VersionDate: 04-27-2011; PCBMarker: Resistor; Publisher: Cowin; PinCountHole: 0
  R38-R40 R64: Value: 200 K
  R41 R52 R56: Value: 22 R
  R42 R45 R46 R48-R51 R62: Value: 10 K
  R43 R44 R53 R57 R58 R60: Value: 100 K
  R47 R61: Value: 1 K
  R54: Value: 4.7 K
  R55: Value: 150 K
  R59: Value: 510 K
  R63: Value: 909 K
  R65: Value: 330 R
U8 = TPS650240: Embedded Power Management IC; PartNumber: TPS650240RHBT; SerialNumber: 0; PinCountSMD: 33; PCBMarker: PMU; Designer: shyul; Vendor: TI; PinCountHole: 0; Publisher: Cowin; Version: 1.0; VersionDate: 05-09-2011; Value: TPS650240; Supplier 1: Digi-Key; Supplier Part Number 1: 296-22475-2-ND
U9 = SI1563EDH: Complementary MOSFET; Vendor: VISHAY; SerialNumber: 0; PCBMarker: FET COMP; PinCountSMD: 6; Designer: shyul; PartNumber: SI1563EDH; Value: SI1563EDH; Version: 1.0; VersionDate: 02-21-2012; Publisher: Cowin; PinCountHole: 0
U10 = ATtiny13A: Atmel SPI Flash; PartNumber: ATtiny13A-SH; Vendor: Microchip; SerialNumber: 0; PinCountSMD: 8; Designer: shyul; Value: ATtiny13A; Version: 1.0; VersionDate: 05-26-2012; PCBMarker: SPI Flash; Publisher: Cowin; PinCountHole: 0
U11 = TPS62260: Simple Switch 600mA Adjustable; PartNumber: TPS62260DDCR; Vendor: TI; PinCountSMD: 5; PinCountHole: 0; Designer: shyul; PCBMarker: Power; Value: TPS62260; Version: 1.0; VersionDate: 05-08-2011; SerialNumber: 0; Publisher: Cowin; Supplier 1: Digi-Key; Supplier Part Number 1: 296-22469-2-ND

## Nets that join several sheets
VBAT: 02_XEM (J1.1 J1.3 J1.5 J1.7), 10_POWER (24 pins)
VDD1V0: 04_ARM_B (13 pins), 10_POWER (5 pins)
VDD1V2: 09_FPGA_E (34 pins), 10_POWER (6 pins)
VDD1V2PLL: 09_FPGA_E (8 pins), 10_POWER (C164.2 C165.2 R58.2 U8.14)
VDD1V8: 03_ARM_A (45 pins), 04_ARM_B (9 pins), 08_FPGA_D (31 pins), 09_FPGA_E (25 pins), 10_POWER (5 pins)
VDD2V5A: 09_FPGA_E (9 pins), 10_POWER (C162.2 C163.2 R55.2 U8.16)
VDD3V3: 02_XEM (8 pins), 03_ARM_A (R7.2), 04_ARM_B (36 pins), 05_FPGA_A (10 pins), 07_FPGA_C (9 pins), 09_FPGA_E (16 pins), 10_POWER (5 pins)
VDD-IOA: 02_XEM (J1.74 J1.76), 06_FPGA_B (5 pins), 09_FPGA_E (5 pins)
VDD-IOB: 02_XEM (J1.202 J1.204), 07_FPGA_C (U6.P18 U6.T19 U6.V19 U6.Y19), 09_FPGA_E (6 pins)
VDD-IOC: 02_XEM (J1.140 J1.142), 06_FPGA_B (5 pins), 09_FPGA_E (C94.2 C95.2 C96.2 C97.2)
VDDBU: 02_XEM (J1.2 J1.4), 04_ARM_B (R19.2 U1.D4), 10_POWER (C143.2 C144.2)
VREF-IOA: 02_XEM (J1.75), 06_FPGA_B (U6.V9 U6.Y4), 09_FPGA_E (C85.2 C86.2)
VREF-IOB: 02_XEM (J1.201), 07_FPGA_C (U6.P20 U6.R17), 09_FPGA_E (C98.2 C99.2)
VREF-IOC: 02_XEM (J1.139), 06_FPGA_B (U6.V16 U6.W14), 09_FPGA_E (C92.2 C93.2)
VSS: 02_XEM (31 pins), 03_ARM_A (48 pins), 04_ARM_B (59 pins), 05_FPGA_A (R28.2 U6.T1), 06_FPGA_B (U6.U11), 07_FPGA_C (5 pins), 08_FPGA_D (24 pins), 09_FPGA_E (149 pins), 10_POWER (47 pins)
AC97-CLK: 04_ARM_B (U1.R8), 07_FPGA_C (U6.H19)
AC97-FS: 04_ARM_B (U1.P8), 07_FPGA_C (U6.J15)
AC97-RX: 04_ARM_B (U1.N8), 07_FPGA_C (U6.J16)
AC97-TX: 04_ARM_B (U1.U7), 07_FPGA_C (U6.H16)
ARM-JRTCK: 02_XEM (J1.53), 04_ARM_B (U1.R11)
ARM-JTCK: 02_XEM (J1.55), 04_ARM_B (R21.1 U1.U10)
ARM-JTDI: 02_XEM (J1.59), 04_ARM_B (R23.1 U1.R10)
ARM-JTDO: 02_XEM (J1.51), 04_ARM_B (U1.V10)
ARM-JTMS: 02_XEM (J1.57), 04_ARM_B (R22.1 U1.P10)
ARM-JTRSTn: 02_XEM (J1.61), 04_ARM_B (R20.1 U1.N10)
DBG-RXD: 02_XEM (J1.41), 04_ARM_B (U1.P6)
DBG-TXD: 02_XEM (J1.43), 04_ARM_B (U1.R6)
FPGA-JTCK: 02_XEM (J1.71), 05_FPGA_A (R28.1 U6.L2)
FPGA-JTDI: 02_XEM (J1.65), 05_FPGA_A (R27.1 U6.L5)
FPGA-JTDO: 02_XEM (J1.69), 05_FPGA_A (U6.L4)
FPGA-JTMS: 02_XEM (J1.67), 05_FPGA_A (R29.1 U6.L1)
FPSC-CFGn: 04_ARM_B (U1.T6), 09_FPGA_E (R36.1 U6.K5)
FPSC-DATA: 04_ARM_B (U1.V5), 05_FPGA_A (U6.K1)
FPSC-DONE: 04_ARM_B (U1.M7), 09_FPGA_E (R35.1 U6.M18)
FPSC-SCLK: 04_ARM_B (U1.U6), 05_FPGA_A (U6.K2)
FPSC-STAT: 04_ARM_B (U1.N7), 09_FPGA_E (R37.1 U6.K6)
GPA28-BTNDIS: 04_ARM_B (U1.U3), 10_POWER (R50.1 U10.7)
GPA30-PINT: 04_ARM_B (U1.R4), 10_POWER (R47.2)
GPB4-TXD1: 02_XEM (J1.33), 04_ARM_B (U1.R5)
GPB5-RXD1: 02_XEM (J1.31), 04_ARM_B (U1.V4)
GPB6-TXD2: 02_XEM (J1.37), 04_ARM_B (U1.T5)
GPB7-RXD2: 02_XEM (J1.35), 04_ARM_B (U1.U5)
GPD1: 02_XEM (J1.21), 04_ARM_B (U1.T7)
GPD2: 02_XEM (J1.19), 04_ARM_B (U1.L8)
GPD3: 02_XEM (J1.25), 04_ARM_B (U1.V6)
GPD4: 02_XEM (J1.23), 04_ARM_B (U1.M8)
GPD5: 02_XEM (J1.27), 04_ARM_B (U1.V7)
GPD16: 02_XEM (J1.29), 04_ARM_B (U1.N9)
IOA0-DIFFn0: 02_XEM (J1.113), 06_FPGA_B (U6.AB9)
IOA1-DIFFp0: 02_XEM (J1.111), 06_FPGA_B (U6.AA9)
IOA2-DIFFn1: 02_XEM (J1.109), 06_FPGA_B (U6.AB8)
IOA3-DIFFp1: 02_XEM (J1.107), 06_FPGA_B (U6.AA8)
IOA4-DIFFn2: 02_XEM (J1.105), 06_FPGA_B (U6.AB7)
IOA5-DIFFp2: 02_XEM (J1.103), 06_FPGA_B (U6.AA7)
IOA6-DIFFn3: 02_XEM (J1.101), 06_FPGA_B (U6.AB5)
IOA7-DIFFp3: 02_XEM (J1.99), 06_FPGA_B (U6.AA5)
IOA8-DIFFn4: 02_XEM (J1.97), 06_FPGA_B (U6.AB4)
IOA9-DIFFp4: 02_XEM (J1.95), 06_FPGA_B (U6.AA4)
IOA10-DIFFn5: 02_XEM (J1.93), 06_FPGA_B (U6.V8)
IOA11-DIFFp5: 02_XEM (J1.91), 06_FPGA_B (U6.U9)
IOA12-DIFFn6: 02_XEM (J1.89), 06_FPGA_B (U6.U10)
IOA13-DIFFp6: 02_XEM (J1.87), 06_FPGA_B (U6.T10)
IOA14-DIFFn7: 02_XEM (J1.85), 06_FPGA_B (U6.T9)
IOA15-DIFFp7: 02_XEM (J1.83), 06_FPGA_B (U6.R10)
IOA16-DIFFn8: 02_XEM (J1.114), 06_FPGA_B (U6.AA10)
IOA17-DIFFp8: 02_XEM (J1.112), 06_FPGA_B (U6.Y10)
IOA18-DIFFn9: 02_XEM (J1.110), 06_FPGA_B (U6.W10)
IOA19-DIFFp9: 02_XEM (J1.108), 06_FPGA_B (U6.V11)
IOA20-DIFFn10: 02_XEM (J1.106), 06_FPGA_B (U6.U8)
IOA21-DIFFp10: 02_XEM (J1.104), 06_FPGA_B (U6.U7)
IOA22-DIFFn11: 02_XEM (J1.102), 06_FPGA_B (U6.Y7)
IOA23-DIFFp11: 02_XEM (J1.100), 06_FPGA_B (U6.W7)
IOA24-DIFFn12: 02_XEM (J1.98), 06_FPGA_B (U6.V7)
IOA25-DIFFp12: 02_XEM (J1.96), 06_FPGA_B (U6.W6)
IOA26-DIFFn13: 02_XEM (J1.94), 06_FPGA_B (U6.V5)
IOA27-DIFFp13: 02_XEM (J1.92), 06_FPGA_B (U6.V6)
IOA28-DIFFn14: 02_XEM (J1.90), 06_FPGA_B (U6.R12)
IOA29-DIFFp14: 02_XEM (J1.88), 06_FPGA_B (U6.R11)
IOA30-DIFFn15: 02_XEM (J1.86), 06_FPGA_B (U6.T8)
IOA31-DIFFp15: 02_XEM (J1.84), 06_FPGA_B (U6.R9)
IOA-CLKIN0p: 02_XEM (J1.78), 06_FPGA_B (U6.AA11)
IOA-CLKIN1n: 02_XEM (J1.80), 06_FPGA_B (U6.AB11)
IOA-CLKOUT0p: 02_XEM (J1.77), 06_FPGA_B (U6.AA3)
IOA-CLKOUT1n: 02_XEM (J1.79), 06_FPGA_B (U6.AB3)
IOB0-DIFFn0: 02_XEM (J1.163), 07_FPGA_C (U6.M15)
IOB1-DIFFp0: 02_XEM (J1.165), 07_FPGA_C (U6.N15)
IOB2-DIFFn1: 02_XEM (J1.167), 07_FPGA_C (U6.N17)
IOB3-DIFFp1: 02_XEM (J1.169), 07_FPGA_C (U6.N18)
IOB4-DIFFn2: 02_XEM (J1.171), 07_FPGA_C (U6.N20)
IOB5-DIFFp2: 02_XEM (J1.173), 07_FPGA_C (U6.N19)
IOB6-DIFFn3: 02_XEM (J1.175), 07_FPGA_C (U6.W20)
IOB7-DIFFp3: 02_XEM (J1.177), 07_FPGA_C (U6.W19)
IOB8-DIFFn4: 02_XEM (J1.179), 07_FPGA_C (U6.Y22)
IOB9-DIFFp4: 02_XEM (J1.181), 07_FPGA_C (U6.Y21)
IOB10-DIFFn5: 02_XEM (J1.183), 07_FPGA_C (U6.W22)
IOB11-DIFFp5: 02_XEM (J1.185), 07_FPGA_C (U6.W21)
IOB12-DIFFn6: 02_XEM (J1.187), 07_FPGA_C (U6.V22)
IOB13-DIFFp6: 02_XEM (J1.189), 07_FPGA_C (U6.V21)
IOB14-DIFFn7: 02_XEM (J1.191), 07_FPGA_C (U6.U22)
IOB15-DIFFp7: 02_XEM (J1.193), 07_FPGA_C (U6.U21)
IOB16-DIFFn8: 02_XEM (J1.164), 07_FPGA_C (U6.P15)
IOB17-DIFFp8: 02_XEM (J1.166), 07_FPGA_C (U6.P16)
IOB18-DIFFn9: 02_XEM (J1.168), 07_FPGA_C (U6.U20)
IOB19-DIFFp9: 02_XEM (J1.170), 07_FPGA_C (U6.U19)
IOB20-DIFFn10: 02_XEM (J1.172), 07_FPGA_C (U6.R18)
IOB21-DIFFp10: 02_XEM (J1.174), 07_FPGA_C (U6.R19)
IOB22-DIFFn11: 02_XEM (J1.176), 07_FPGA_C (U6.M20)
IOB23-DIFFp11: 02_XEM (J1.178), 07_FPGA_C (U6.M19)
IOB24-DIFFn12: 02_XEM (J1.180), 07_FPGA_C (U6.R22)
IOB25-DIFFp12: 02_XEM (J1.182), 07_FPGA_C (U6.R21)
IOB26-DIFFn13: 02_XEM (J1.184), 07_FPGA_C (U6.P22)
IOB27-DIFFp13: 02_XEM (J1.186), 07_FPGA_C (U6.P21)
IOB28-DIFFn14: 02_XEM (J1.188), 07_FPGA_C (U6.N22)
IOB29-DIFFp14: 02_XEM (J1.190), 07_FPGA_C (U6.N21)
IOB30-DIFFn15: 02_XEM (J1.192), 07_FPGA_C (U6.M22)
IOB31-DIFFp15: 02_XEM (J1.194), 07_FPGA_C (U6.M21)
IOB-CLKIN0p: 02_XEM (J1.200), 07_FPGA_C (U6.T21)
IOB-CLKIN1n: 02_XEM (J1.198), 07_FPGA_C (U6.T22)
IOB-CLKOUT0p: 02_XEM (J1.199), 07_FPGA_C (U6.P14)
IOB-CLKOUT1n: 02_XEM (J1.197), 07_FPGA_C (U6.N14)
IOC0: 02_XEM (J1.117), 06_FPGA_B (U6.T14)
IOC1: 02_XEM (J1.119), 06_FPGA_B (U6.T15)
IOC2: 02_XEM (J1.121), 06_FPGA_B (U6.AA13)
IOC3: 02_XEM (J1.123), 06_FPGA_B (U6.AB13)
IOC4: 02_XEM (J1.125), 06_FPGA_B (U6.AA14)
IOC5: 02_XEM (J1.127), 06_FPGA_B (U6.AB14)
IOC6: 02_XEM (J1.129), 06_FPGA_B (U6.AA15)
IOC7: 02_XEM (J1.131), 06_FPGA_B (U6.AB15)
IOC8: 02_XEM (J1.145), 06_FPGA_B (U6.AB16)
IOC9: 02_XEM (J1.147), 06_FPGA_B (U6.AA16)
IOC10: 02_XEM (J1.149), 06_FPGA_B (U6.AB17)
IOC11: 02_XEM (J1.151), 06_FPGA_B (U6.AA17)
IOC12: 02_XEM (J1.153), 06_FPGA_B (U6.AB18)
IOC13: 02_XEM (J1.155), 06_FPGA_B (U6.AA18)
IOC14: 02_XEM (J1.157), 06_FPGA_B (U6.AB19)
IOC15: 02_XEM (J1.159), 06_FPGA_B (U6.AA19)
IOC16: 02_XEM (J1.118), 06_FPGA_B (U6.R15)
IOC17: 02_XEM (J1.120), 06_FPGA_B (U6.R14)
IOC18: 02_XEM (J1.122), 06_FPGA_B (U6.U12)
IOC19: 02_XEM (J1.124), 06_FPGA_B (U6.T12)
IOC20: 02_XEM (J1.126), 06_FPGA_B (U6.W13)
IOC21: 02_XEM (J1.128), 06_FPGA_B (U6.Y13)
IOC22: 02_XEM (J1.130), 06_FPGA_B (U6.U13)
IOC23: 02_XEM (J1.132), 06_FPGA_B (U6.V14)
IOC24: 02_XEM (J1.146), 06_FPGA_B (U6.U14)
IOC25: 02_XEM (J1.148), 06_FPGA_B (U6.U15)
IOC26: 02_XEM (J1.150), 06_FPGA_B (U6.W15)
IOC27: 02_XEM (J1.152), 06_FPGA_B (U6.V15)
IOC28: 02_XEM (J1.154), 06_FPGA_B (U6.W17)
IOC29: 02_XEM (J1.156), 06_FPGA_B (U6.Y17)
IOC30: 02_XEM (J1.158), 06_FPGA_B (U6.AA20)
IOC31: 02_XEM (J1.160), 06_FPGA_B (U6.AB20)
IOC-CLKIN0: 02_XEM (J1.138), 06_FPGA_B (U6.AA12)
IOC-CLKIN1: 02_XEM (J1.136), 06_FPGA_B (U6.AB12)
IOC-CLKOUT0: 02_XEM (J1.137), 06_FPGA_B (U6.T16)
IOC-CLKOUT1: 02_XEM (J1.135), 06_FPGA_B (U6.R16)
ISI-DATA0: 04_ARM_B (U1.P12), 07_FPGA_C (U6.L15)
ISI-DATA1: 04_ARM_B (U1.T15), 07_FPGA_C (U6.K22)
ISI-DATA2: 04_ARM_B (U1.R12), 07_FPGA_C (U6.K16)
ISI-DATA3: 04_ARM_B (U1.T16), 07_FPGA_C (U6.L21)
ISI-DATA4: 04_ARM_B (U1.N12), 07_FPGA_C (U6.L16)
ISI-DATA5: 04_ARM_B (U1.M12), 07_FPGA_C (U6.J18)
ISI-DATA6: 04_ARM_B (U1.U14), 07_FPGA_C (U6.C20)
ISI-DATA7: 04_ARM_B (U1.M13), 07_FPGA_C (U6.H20)
ISI-DATA8: 04_ARM_B (U1.T12), 07_FPGA_C (U6.K15)
ISI-DATA9: 04_ARM_B (U1.N11), 07_FPGA_C (U6.J17)
ISI-DATA10: 04_ARM_B (U1.U13), 07_FPGA_C (U6.G18)
ISI-DATA11: 04_ARM_B (U1.M11), 07_FPGA_C (U6.K17)
ISI-HSYNC: 04_ARM_B (U1.T13), 07_FPGA_C (U6.H17)
ISI-MCLK: 04_ARM_B (U1.P13), 07_FPGA_C (U6.G21)
ISI-PCLK: 04_ARM_B (U1.N13), 07_FPGA_C (U6.K18)
ISI-VSYNC: 04_ARM_B (U1.R13), 07_FPGA_C (U6.G17)
LCD-DATA0: 04_ARM_B (U1.H6), 08_FPGA_D (U6.B4)
LCD-DATA1: 04_ARM_B (U1.G6), 08_FPGA_D (U6.C4)
LCD-DATA2: 04_ARM_B (U1.H7), 08_FPGA_D (U6.F9)
LCD-DATA3: 04_ARM_B (U1.H8), 08_FPGA_D (U6.G7)
LCD-DATA4: 04_ARM_B (U1.G8), 08_FPGA_D (U6.G9)
LCD-DATA5: 04_ARM_B (U1.J5), 08_FPGA_D (U6.F7)
LCD-DATA6: 04_ARM_B (U1.H4), 08_FPGA_D (U6.E5)
LCD-DATA7: 04_ARM_B (U1.J3), 08_FPGA_D (U6.C7)
LCD-DATA8: 04_ARM_B (U1.J4), 08_FPGA_D (U6.A3)
LCD-DATA9: 04_ARM_B (U1.J2), 08_FPGA_D (U6.B5)
LCD-DATA10: 04_ARM_B (U1.J6), 08_FPGA_D (U6.F12)
LCD-DATA11: 04_ARM_B (U1.J7), 08_FPGA_D (U6.E7)
LCD-DATA12: 04_ARM_B (U1.J1), 08_FPGA_D (U6.A5)
LCD-DATA13: 04_ARM_B (U1.J8), 08_FPGA_D (U6.G8)
LCD-DATA14: 04_ARM_B (U1.K1), 08_FPGA_D (U6.A6)
LCD-DATA15: 04_ARM_B (U1.K4), 08_FPGA_D (U6.G14)
LCD-DATA16: 04_ARM_B (U1.K2), 08_FPGA_D (U6.C8)
LCD-DATA17: 04_ARM_B (U1.K5), 08_FPGA_D (U6.B6)
LCD-DATA18: 04_ARM_B (U1.K6), 08_FPGA_D (U6.C6)
LCD-DATA19: 04_ARM_B (U1.K3), 08_FPGA_D (U6.F14)
LCD-DATA20: 04_ARM_B (U1.K7), 08_FPGA_D (U6.G13)
LCD-DATA21: 04_ARM_B (U1.K8), 08_FPGA_D (U6.H13)
LCD-DATA22: 04_ARM_B (U1.L3), 08_FPGA_D (U6.C10)
LCD-DATA23: 04_ARM_B (U1.L2), 08_FPGA_D (U6.A4)
LCD-DEN: 04_ARM_B (U1.G3), 08_FPGA_D (U6.B3)
LCD-HSYNC: 04_ARM_B (U1.G7), 08_FPGA_D (U6.F8)
LCD-PCLK: 04_ARM_B (U1.H5), 08_FPGA_D (U6.E6)
LCD-VSYNC: 04_ARM_B (U1.F5), 08_FPGA_D (U6.C3)
M1-ADDR2: 03_ARM_A (U1.F18), 05_FPGA_A (U6.V1)
M1-ADDR3: 03_ARM_A (U1.F15), 05_FPGA_A (U6.W1)
M1-ADDR4: 03_ARM_A (U1.E14), 05_FPGA_A (U6.R5)
M1-ADDR5: 03_ARM_A (U1.F17), 05_FPGA_A (U6.V2)
M1-ADDR6: 03_ARM_A (U1.F16), 05_FPGA_A (U6.AA1)
M1-ADDR7: 03_ARM_A (U1.E17), 05_FPGA_A (U6.U1)
M1-ADDR8: 03_ARM_A (U1.E15), 05_FPGA_A (U6.Y2)
M1-ADDR9: 03_ARM_A (U1.E16), 05_FPGA_A (U6.Y1)
M1-ADDR10: 03_ARM_A (U1.D18), 05_FPGA_A (U6.U2)
M1-ADDR11: 03_ARM_A (U1.D17), 05_FPGA_A (U6.R1)
M1-ADDR12: 03_ARM_A (U1.C18), 05_FPGA_A (U6.R2)
M1-ADDR13: 03_ARM_A (U1.B18), 05_FPGA_A (U6.P2)
M1-ADDR14: 03_ARM_A (U1.A18), 05_FPGA_A (U6.N2)
M1-ADDR15: 03_ARM_A (U1.B17), 05_FPGA_A (U6.N1)
M1-ADDR16: 03_ARM_A (U1.C10), 05_FPGA_A (U6.D1)
M1-ADDR17: 03_ARM_A (U1.B10), 05_FPGA_A (U6.E1)
M1-ADDR18: 03_ARM_A (U1.C17), 05_FPGA_A (U6.P1)
M1-ADDR19: 03_ARM_A (U1.B8), 05_FPGA_A (U6.C2)
M1-ADDR20: 03_ARM_A (U1.C8), 05_FPGA_A (U6.P8)
M1-ADDR21: 03_ARM_A (U1.F9), 05_FPGA_A (U6.P7)
M1-ADDR22: 03_ARM_A (U1.A7), 05_FPGA_A (U6.B1)
M1-ADDR23: 03_ARM_A (U1.D8), 05_FPGA_A (U6.M7)
M1-BEn0: 03_ARM_A (U1.F13), 05_FPGA_A (U6.R6)
M1-BEn1: 03_ARM_A (U1.D9), 05_FPGA_A (U6.R8)
M1-BEn2: 03_ARM_A (U1.F14), 05_FPGA_A (U6.P3)
M1-BEn3: 03_ARM_A (U1.A9), 05_FPGA_A (U6.D2)
M1-CLK: 03_ARM_A (R8.2), 05_FPGA_A (U6.T2)
M1-CSn0: 03_ARM_A (U1.A10), 05_FPGA_A (U6.E2)
M1-CSn1: 03_ARM_A (U1.F10), 05_FPGA_A (U6.P5)
M1-CSn2: 03_ARM_A (U1.D7), 05_FPGA_A (U6.M8)
M1-CSn3: 03_ARM_A (U1.F8), 05_FPGA_A (U6.N7)
M1-DATA0: 03_ARM_A (U1.A17), 05_FPGA_A (U6.M1)
M1-DATA1: 03_ARM_A (U1.D15), 05_FPGA_A (U6.W2)
M1-DATA2: 03_ARM_A (U1.C15), 05_FPGA_A (U6.V3)
M1-DATA3: 03_ARM_A (U1.B16), 05_FPGA_A (U6.M2)
M1-DATA4: 03_ARM_A (U1.B15), 05_FPGA_A (U6.J1)
M1-DATA5: 03_ARM_A (U1.D14), 05_FPGA_A (U6.V4)
M1-DATA6: 03_ARM_A (U1.C14), 05_FPGA_A (U6.T7)
M1-DATA7: 03_ARM_A (U1.A15), 05_FPGA_A (U6.J2)
M1-DATA8: 03_ARM_A (U1.B14), 05_FPGA_A (U6.H1)
M1-DATA9: 03_ARM_A (U1.D13), 05_FPGA_A (U6.R7)
M1-DATA10: 03_ARM_A (U1.C13), 05_FPGA_A (U6.T5)
M1-DATA11: 03_ARM_A (U1.E13), 05_FPGA_A (U6.T3)
M1-DATA12: 03_ARM_A (U1.B13), 05_FPGA_A (U6.H2)
M1-DATA13: 03_ARM_A (U1.E12), 05_FPGA_A (U6.T4)
M1-DATA14: 03_ARM_A (U1.D12), 05_FPGA_A (U6.F2)
M1-DATA15: 03_ARM_A (U1.C12), 05_FPGA_A (U6.F1)
M1-DATA16: 03_ARM_A (U1.E7), 05_FPGA_A (U6.N8)
M1-DATA17: 03_ARM_A (U1.B5), 05_FPGA_A (U6.G3)
M1-DATA18: 03_ARM_A (U1.D6), 05_FPGA_A (U6.L7)
M1-DATA19: 03_ARM_A (U1.F7), 05_FPGA_A (U6.L6)
M1-DATA20: 03_ARM_A (U1.A4), 05_FPGA_A (U6.G4)
M1-DATA21: 03_ARM_A (U1.C5), 05_FPGA_A (U6.H5)
M1-DATA22: 03_ARM_A (U1.B4), 05_FPGA_A (U6.G5)
M1-DATA23: 03_ARM_A (U1.E6), 05_FPGA_A (U6.J3)
M1-DATA24: 03_ARM_A (U1.D5), 05_FPGA_A (U6.J4)
M1-DATA25: 03_ARM_A (U1.A3), 05_FPGA_A (U6.H6)
M1-DATA26: 03_ARM_A (U1.C4), 05_FPGA_A (U6.J6)
M1-DATA27: 03_ARM_A (U1.A1), 05_FPGA_A (U6.E4)
M1-DATA28: 03_ARM_A (U1.A2), 05_FPGA_A (U6.K7)
M1-DATA29: 03_ARM_A (U1.B2), 05_FPGA_A (U6.J7)
M1-DATA30: 03_ARM_A (U1.B3), 05_FPGA_A (U6.E3)
M1-DATA31: 03_ARM_A (U1.B1), 05_FPGA_A (U6.H7)
M1-EINT0: 04_ARM_B (U1.U8), 05_FPGA_A (U6.L8)
M1-EINT1: 04_ARM_B (U1.T8), 07_FPGA_C (U6.K21)
M1-EINT2: 04_ARM_B (U1.L9), 05_FPGA_A (U6.M6)
M1-EINT3: 04_ARM_B (U1.U9), 05_FPGA_A (U6.K8)
M1-EINT4: 04_ARM_B (U1.V9), 05_FPGA_A (U6.M4)
M1-EINT5: 04_ARM_B (U1.R9), 05_FPGA_A (U6.P6)
M1-EINT6: 04_ARM_B (U1.T9), 05_FPGA_A (U6.M3)
M1-EINT7: 04_ARM_B (U1.T4), 07_FPGA_C (U6.J21)
M1-EINT8: 04_ARM_B (U1.F4), 08_FPGA_D (U6.F10)
M1-EINT9: 04_ARM_B (U1.G5), 08_FPGA_D (U6.G10)
M1-RDn: 03_ARM_A (U1.F11), 05_FPGA_A (U6.P4)
M1-RSTn: 04_ARM_B (U1.U1), 07_FPGA_C (U6.J22)
M1-WAITn: 03_ARM_A (R7.1 U1.C6), 05_FPGA_A (U6.B2)
M1-WRn: 03_ARM_A (U1.C9), 05_FPGA_A (U6.C1)
M2-CLK0: 03_ARM_A (U1.G4), 08_FPGA_D (U6.B11)
M2-CLK1: 03_ARM_A (U1.L4), 08_FPGA_D (U6.B12)
PD20-TIOA0: 04_ARM_B (U1.D2), 07_FPGA_C (U6.F17)
PD21-TIOA1: 04_ARM_B (U1.E1), 07_FPGA_C (U6.F20)
PD22-TIOA2: 04_ARM_B (U1.F1), 07_FPGA_C (U6.D20)
PD23-TCLK0: 04_ARM_B (U1.G2), 07_FPGA_C (U6.F19)
PD29-TCLK1: 04_ARM_B (U1.L10), 05_FPGA_A (U6.N6)
PD30-TIOB0: 04_ARM_B (U1.T10), 05_FPGA_A (U6.M5)
PD31-TIOB1: 04_ARM_B (U1.L11), 05_FPGA_A (U6.N5)
PWR-EN: 02_XEM (J1.8), 10_POWER (7 pins)
PWRFAILn: 04_ARM_B (U1.L7), 10_POWER (R56.2)
PWRMODE: 04_ARM_B (U1.P7), 10_POWER (R52.2)
RMII0-CRSDV: 02_XEM (J1.52), 04_ARM_B (U1.N4)
RMII0-MDCK: 02_XEM (J1.54), 04_ARM_B (U1.R1)
RMII0-MDINT: 02_XEM (J1.58), 04_ARM_B (U1.M9)
RMII0-MDIO: 02_XEM (J1.56), 04_ARM_B (U1.P3)
RMII0-REFCLK: 02_XEM (J1.24), 04_ARM_B (U1.N6)
RMII0-RPTR: 02_XEM (J1.50), 04_ARM_B (U1.N5)
RMII0-RX0: 02_XEM (J1.46), 04_ARM_B (U1.N3)
RMII0-RX1: 02_XEM (J1.44), 04_ARM_B (U1.P2)
RMII0-TX0: 02_XEM (J1.34), 04_ARM_B (U1.M5)
RMII0-TX1: 02_XEM (J1.32), 04_ARM_B (U1.P1)
RMII0-TXEN: 02_XEM (J1.36), 04_ARM_B (U1.M6)
RSTn-BTN: 02_XEM (J1.13), 04_ARM_B (R25.1 U1.M10)
SD0-CDn: 02_XEM (RN1.6), 04_ARM_B (U1.H2)
SD0-CLK: 02_XEM (RN1.2), 04_ARM_B (U1.L1)
SD0-CMD: 02_XEM (RN2.8), 04_ARM_B (U1.M1)
SD0-DATA0: 02_XEM (RN1.4), 04_ARM_B (U1.L5)
SD0-DATA1: 02_XEM (RN2.2), 04_ARM_B (U1.N1)
SD0-DATA2: 02_XEM (RN2.6), 04_ARM_B (U1.L6)
SD0-DATA3: 02_XEM (RN2.4), 04_ARM_B (U1.M2)
SD1-CLK: 02_XEM (J1.68), 04_ARM_B (U1.V1)
SD1-CMD: 02_XEM (J1.66), 04_ARM_B (U1.T1)
SD1-DATA0: 02_XEM (J1.70), 04_ARM_B (U1.P5)
SD1-DATA1: 02_XEM (J1.72), 04_ARM_B (U1.R3)
SD1-DATA2: 02_XEM (J1.62), 04_ARM_B (U1.T2)
SD1-DATA3: 02_XEM (J1.64), 04_ARM_B (U1.T3)
SYS-RESETn: 02_XEM (J1.15), 04_ARM_B (U4.2)
SYS-SHDNn: 04_ARM_B (U1.F3), 10_POWER (R42.2)
SYS-WKUP: 04_ARM_B (R19.1 U1.C3), 10_POWER (R46.2)
UOTG-DM: 02_XEM (J1.14), 04_ARM_B (R18.1 U1.U16)
UOTG-DP: 02_XEM (J1.12), 04_ARM_B (R15.1 U1.U15)
USBH-DM: 02_XEM (J1.20), 04_ARM_B (R14.1 U1.R17)
USBH-DP: 02_XEM (J1.18), 04_ARM_B (R13.1 U1.T17)
WKUP-BTN: 02_XEM (J1.11), 10_POWER (R51.1 U10.2)